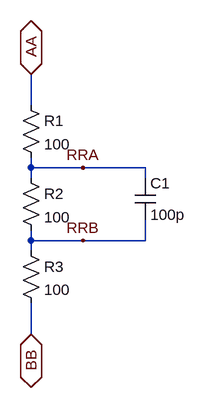
[diagram p0: schematic R3R.asc]
R3R.asc, the LTspice schematic file:
Version 4
SHEET 1 880 680
WIRE 176 80 176 32
WIRE 176 176 176 160
WIRE 256 176 176 176
WIRE 352 176 256 176
WIRE 176 192 176 176
WIRE 352 192 352 176
WIRE 176 288 176 272
WIRE 256 288 176 288
WIRE 352 288 352 256
WIRE 352 288 256 288
WIRE 176 304 176 288
WIRE 176 432 176 384
FLAG 256 176 RRA
FLAG 256 288 RRB
FLAG 176 32 AA
IOPIN 176 32 BiDir
FLAG 176 432 BB
IOPIN 176 432 BiDir
SYMBOL res 160 64 R0
SYMATTR InstName R1
SYMATTR Value 100
SYMBOL res 160 176 R0
SYMATTR InstName R2
SYMATTR Value 100
SYMBOL res 160 288 R0
SYMATTR InstName R3
SYMATTR Value 100
SYMBOL cap 336 192 R0
SYMATTR InstName C1
SYMATTR Value 100p

The netlist it stands for:
* R3R.asc
R1 AA RRA 100
R2 RRA RRB 100
R3 RRB BB 100
C1 RRA RRB 100p
.backanno
.end